# EAGLE design Adafruit USB Serial Char LCD (EAGLE 6.4)
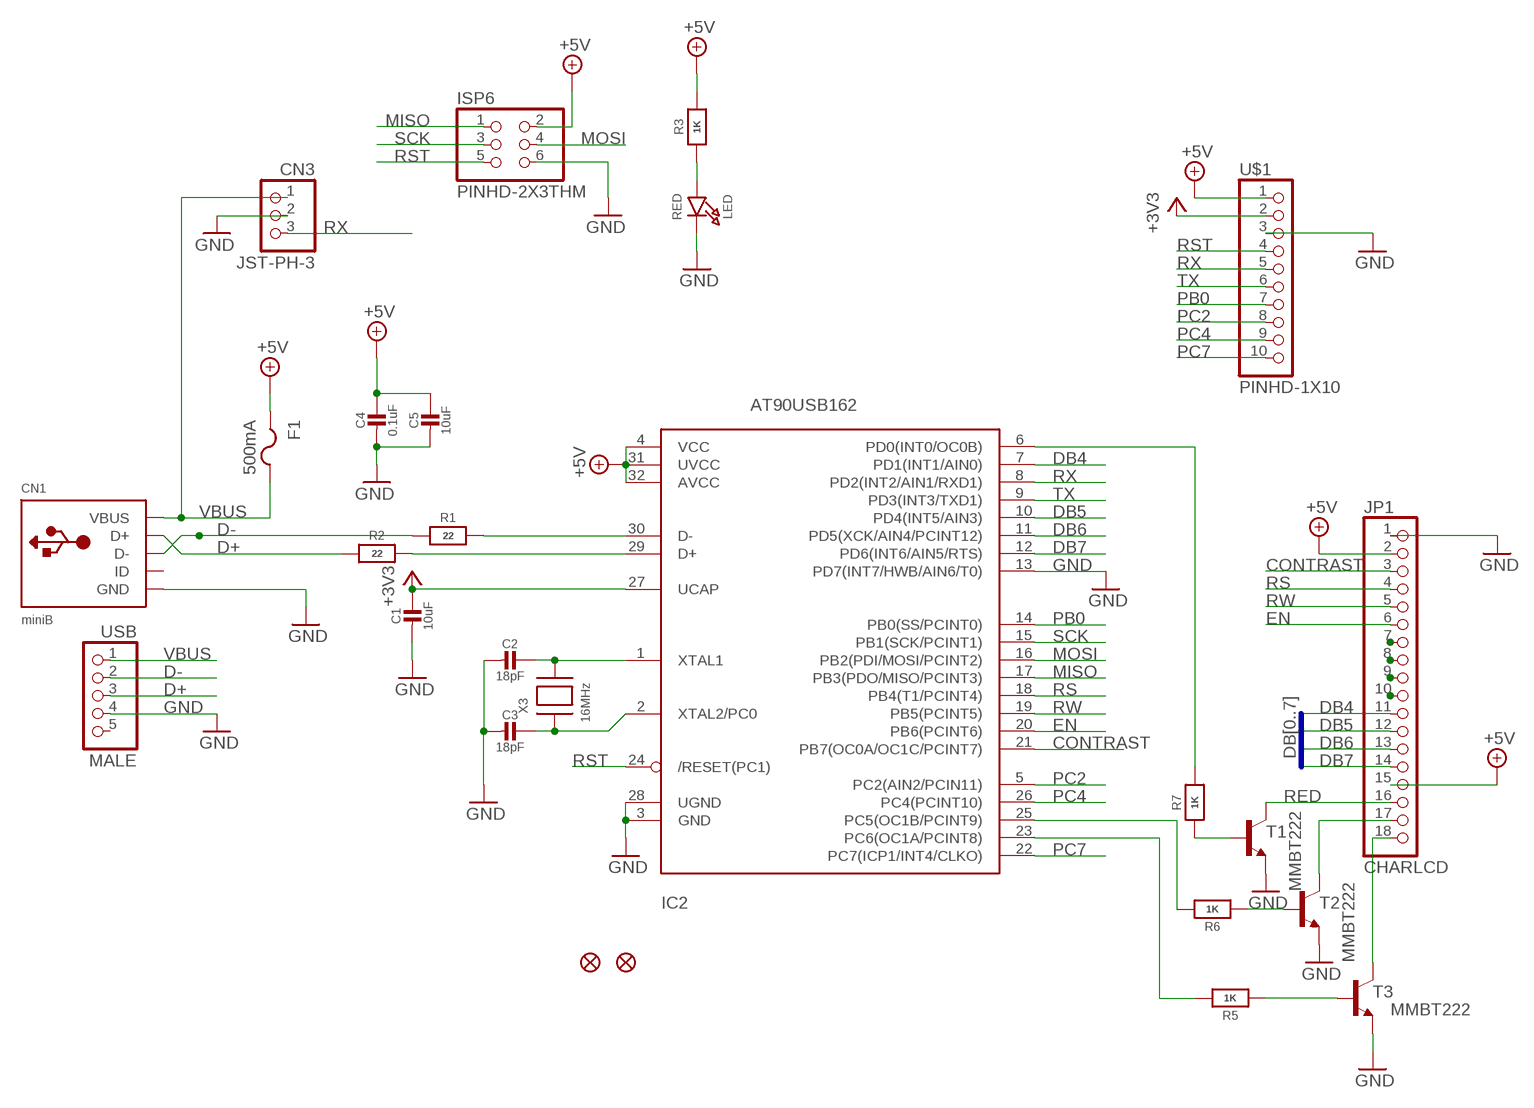
[diagram p0: schematic, sheet 1]

## Parts
C1  10uF  CAP_CERAMIC0805-NOOUTLINE  [0805-NO]
C2  18pF  CAP_CERAMIC0805-NOOUTLINE  [0805-NO]
C3  18pF  CAP_CERAMIC0805-NOOUTLINE  [0805-NO]
C4  0.1uF  CAP_CERAMIC0805-NOOUTLINE  [0805-NO]
C5  10uF  CAP_CERAMIC0805-NOOUTLINE  [0805-NO]
CN1  miniB  USBMINIBLARGE  [USB-MINIB_LARGER]
CN3  JST-PH-3  JST_3PIN  [JSTPH3]
F1  500mA  PTCFUSE-1206  [R1206]
FID1  FIDUCIAL1X2.5  [FIDUCIAL-1X2.5]
FID2  FIDUCIAL1X2.5  [FIDUCIAL-1X2.5]
IC2  AT90USB162  ATMEGA32U2-TQFP  [TQFP32-08]
ISP6  PINHD-2X3THM  [ISP6]
JP1  CHARLCD  PINHD-1X18-BIG  [1X18-BIG]
LED  RED  LED0805_NOOUTLINE  [CHIPLED_0805_NOOUTLINE]
R1  22  RESISTOR0805_NOOUTLINE  [0805-NO]
R2  22  RESISTOR0805_NOOUTLINE  [0805-NO]
R3  1K  RESISTOR0805_NOOUTLINE  [0805-NO]
R5  1K  RESISTOR0805_NOOUTLINE  [0805-NO]
R6  1K  RESISTOR0805_NOOUTLINE  [0805-NO]
R7  1K  RESISTOR0805_NOOUTLINE  [0805-NO]
T1  MMBT222  MMBT2222ALT1-NPN-SOT23-BEC  [SOT23-BEC]
T2  MMBT222  MMBT2222ALT1-NPN-SOT23-BEC  [SOT23-BEC]
T3  MMBT222  MMBT2222ALT1-NPN-SOT23-BEC  [SOT23-BEC]
U$1  PINHD-1X10  [1X10-BIG]
USB  MALE  PINHD-1X5  [1X05]
X3  16MHz  XTALNX5032  [NX5032]

## Nets
+3V3: C1.1 IC2.27(UCAP) U$1.2
+5V: C4.1 C5.1 F1.1 IC2.4(VCC) IC2.31(UVCC) IC2.32(AVCC) ISP6.2 JP1.2 JP1.15 R3.2 U$1.1
BLUE: JP1.18 T3.C
CONTRAST: IC2.21(PB7(OC0A/OC1C/PCINT7)) JP1.3
D+: CN1.D+ R2.1 USB.3
D-: CN1.D- R1.1 USB.2
DB0: JP1.7
DB1: JP1.8
DB2: JP1.9
DB3: JP1.10
DB4: IC2.7(PD1(INT1/AIN0)) JP1.11
DB5: IC2.10(PD4(INT5/AIN3)) JP1.12
DB6: IC2.11(PD5(XCK/AIN4/PCINT12)) JP1.13
DB7: IC2.12(PD6(INT6/AIN5/RTS)) JP1.14
EN: IC2.20(PB6(PCINT6)) JP1.6
GND: C1.2 C2.2 C3.2 C4.2 C5.2 CN1.GND CN3.2 IC2.3(GND) IC2.13(PD7(INT7/HWB/AIN6/T0)) IC2.28(UGND) ISP6.6 JP1.1 LED.C T1.E T2.E T3.E U$1.3 USB.4
GREEN: JP1.17 T2.C
MISO: IC2.17(PB3(PDO/MISO/PCINT3)) ISP6.1
MOSI: IC2.16(PB2(PDI/MOSI/PCINT2)) ISP6.4
N$1: LED.A R3.1
N$2: R7.1 T1.B
N$3: IC2.30(D-) R1.2
N$4: IC2.29(D+) R2.2
N$5: IC2.6(PD0(INT0/OC0B)) R7.2
N$6: R6.1 T2.B
N$7: IC2.25(PC5(OC1B/PCINT9)) R6.2
N$8: C2.1 IC2.1(XTAL1) X3.P$2
N$9: C3.1 IC2.2(XTAL2/PC0) X3.P$1
N$10: IC2.23(PC6(OC1A/PCINT8)) R5.2
N$11: R5.1 T3.B
PB0: IC2.14(PB0(SS/PCINT0)) U$1.7
PC2: IC2.5(PC2(AIN2/PCIN11)) U$1.8
PC4: IC2.26(PC4(PCINT10)) U$1.9
PC7: IC2.22(PC7(ICP1/INT4/CLKO)) U$1.10
RED: JP1.16 T1.C
RS: IC2.18(PB4(T1/PCINT4)) JP1.4
RST: IC2.24(/RESET(PC1)) ISP6.5 U$1.4
RW: IC2.19(PB5(PCINT5)) JP1.5
RX: CN3.3 IC2.8(PD2(INT2/AIN1/RXD1)) U$1.5
SCK: IC2.15(PB1(SCK/PCINT1)) ISP6.3
TX: IC2.9(PD3(INT3/TXD1)) U$1.6
VBUS: CN1.VBUS CN3.1 F1.2 USB.1
Unconnected: CN1.ID USB.5

## Buses
DB[0..7]

## Library data of the parts
C1-C5 = microbuilder:CAP_CERAMIC: Ceramic Capacitors For new designs, use the packages preceded by an '_' character since they are more reliable: The following footprints should be used on most boards: _0402 - Standard footprint for regular board layouts _0603 - Standard footprint for regular board layouts _0805 - Standard footprint for regular board layouts _1206 - Standard footprint for regular board layouts For extremely tight-pitch boards where space is at a premium, the following 'micro-pitch' footprints can be used (smaller pads, no silkscreen outline, etc.): _0402MP - Micro-pitch footprint for very dense/compact boards _0603MP - Micro-pitch footprint for very dense/compact boards _0805MP - Micro-pitch footprint for very dense/compact boards _1206MP - Micro-pitch footprint for very dense/compact boards
CN1 = microbuilder:USB: USB Connectors USBMINIB - Surface Mount Female Mini-B USB Connector 4UConnector: 06564
CN3 = microbuilder:JST_3PIN
F1 = adafruit:PTCFUSE: PTC fuses, resettable thermistors
FID1 FID2 = microbuilder:FIDUCIAL: Fiducial Alignment Points Various fiducial points for machine vision alignment.
IC2 = adafruit:ATMEGA32U2: ATmega32u2 Pin compatible with the atmega8u2, atmega16u2 and atmega32u2 8, 16 or 32 K flash, 1K RAM, 512b EEPROM 8 bit and 16 bit timer (5 PWM total) UART, SPI (no I2C!) USB with 4 endpoints, LUFA compatible 22 I/O lines, analog comparator (no ADC!) Comes with DFU bootloader burned in!
ISP6 = adaprog:PINHD-2X3
JP1 = adafruit:PINHD-1X18: PIN HEADER
LED = microbuilder:LED: LED 0603 - 0603 Surface Mount Package 2mA: Green LED - Low Power (3.9mcd, 2ma, 1.7Vf) - Digikey: 475-2709-2-ND Orange LED - Low Power (9.8mcd, 2ma, 1.8Vf) - Digikey: 475-1194-2-ND Red LED - Low Power (5mcd, 2ma, 1.8Vf) - Digikey: 475-1195-2-ND Yellow LED - Low Power (7mcd, 2ma, 1.8Vf) - Digikey: 475-1196-2-ND 5mA: Blue LED - Low Power (17mcd, 5ma, 2.9Vf) - Digikey: LNJ937W8CRACT-ND 0805 - 0805 Surface Mount Package 2mA: Red LED (8.8mcd, 2mA, 1.8Vf, Clear) - Low Power [Digikey: 475-2510-1-ND] Green LED (5mcd, 2mA, 1.8Vf, Clear) - Low Power [Digikey: 475-2730-1-ND] Yellow LED (11.3mcd, 2mA, 1.8Vf, Clear) - Low Power [Digikey: 475-2555-1-ND] 20mA: Red LED (104mcd, 20mA, Diffused) - LS R976 [Digikey: 475-1278-6-ND] Red LED (12mcd, 20mA, 2.0Vf, Clear) - APT2012EC [Digikey: 754-1128-1-ND] Green LED (15mcd, 20mA, 2.2Vf, Clear) - APT2012GC [Digikey: 754-1131-1-ND] Orange LED (160mcd, 20mA, 2.1Vf, Clear) - APT2012SECK [Digikey: 754-1130-1-ND] 1206 - 1206 Surface Mount Package Green LED (26mcd, 20mA, Diffused) - LG N971 [Digikey: 475-1407-6-ND] Red LED (15mcd, 20mA, Diffused) - LH N974 [Digikey: 475-1416-6-ND] Cree - Cree High-Power Surface Mount LEDs XPEBWT-L1-0000-00D50 - White 111lm 350mA 2.9Vf 6200K 110° XTEAWT-00-0000-00000LEE3 - White 114lm 350mA 2.85Vf 5000K 115° Everlight - Everlight 45-21 Series Surface Mount LEDs 45-21/QK2C-B2832AC2CB2/2T - Warm White 2000mcd 20mA 3.25Vf 3050K 120° 45-21/LK2C-B38452C4CB2/2T - Nuetral White 2000mcd 20mA 3.25Vf 4150K 120° 45-21/LK2C-B50634C6CB2/2T - Cold White 2200mcd 20mA 3.25Vf 5650K 120° PLCC2 Reverse Mount LS T77K-J1L2-1-0-2-R18-Z - Red 11.25mcd 2mA 1.8Vf 630nm 120° LO T77K-L1M2-24-Z - Orange 19.6mcd 2mA 1.8Vf 606nm 120° LY T77K-K2M1-26-Z - Yellow 15.7mcd 2mA 1.8Vf 587nm 120°
R1-R3 R5-R7 = microbuilder:RESISTOR: Resistors For new designs, use the packages preceded by an '_' character since they are more reliable: The following footprints should be used on most boards: _0402 - Standard footprint for regular board layouts _0603 - Standard footprint for regular board layouts _0805 - Standard footprint for regular board layouts _1206 - Standard footprint for regular board layouts For extremely tight-pitch boards where space is at a premium, the following 'micro-pitch' footprints can be used (smaller pads, no silkscreen outline, etc.): _0402MP - Micro-pitch footprint for very dense/compact boards _0603MP - Micro-pitch footprint for very dense/compact boards _0805MP - Micro-pitch footprint for very dense/compact boards _1206MP - Micro-pitch footprint for very dense/compact boards
T1-T3 = transistor:*-NPN-: NPN Transistror BF959 corrected 2008.03.06
U$1 = adafruit:PINHD-1X10: Pin header 1x10 0.1" spacing With round pins
USB = pinhead:PINHD-1X5: PIN HEADER
X3 = adafruit:XTAL: Low cost SMT crystals, no capacitors included http://www.ladyada.net/library/eagle

## Board
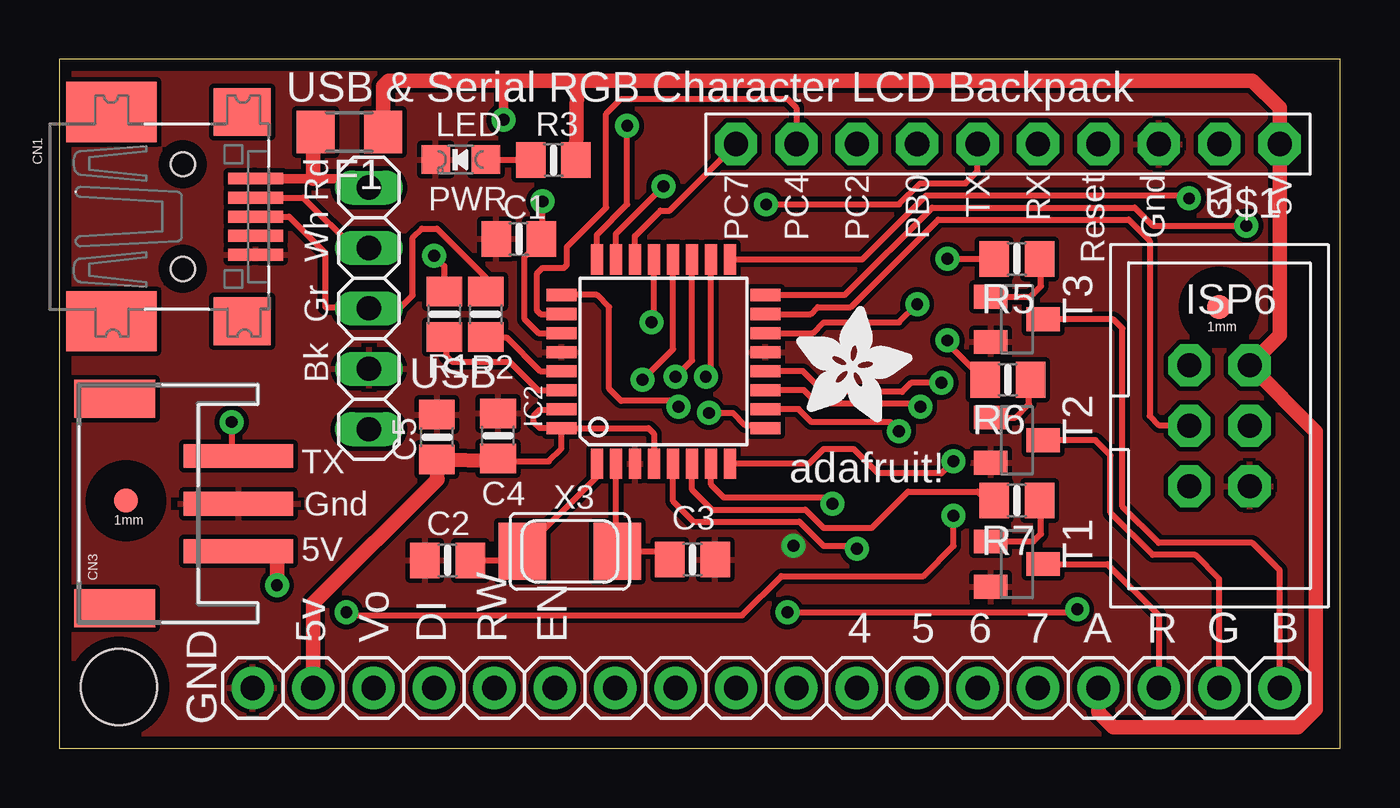
[diagram p1: board, top side]
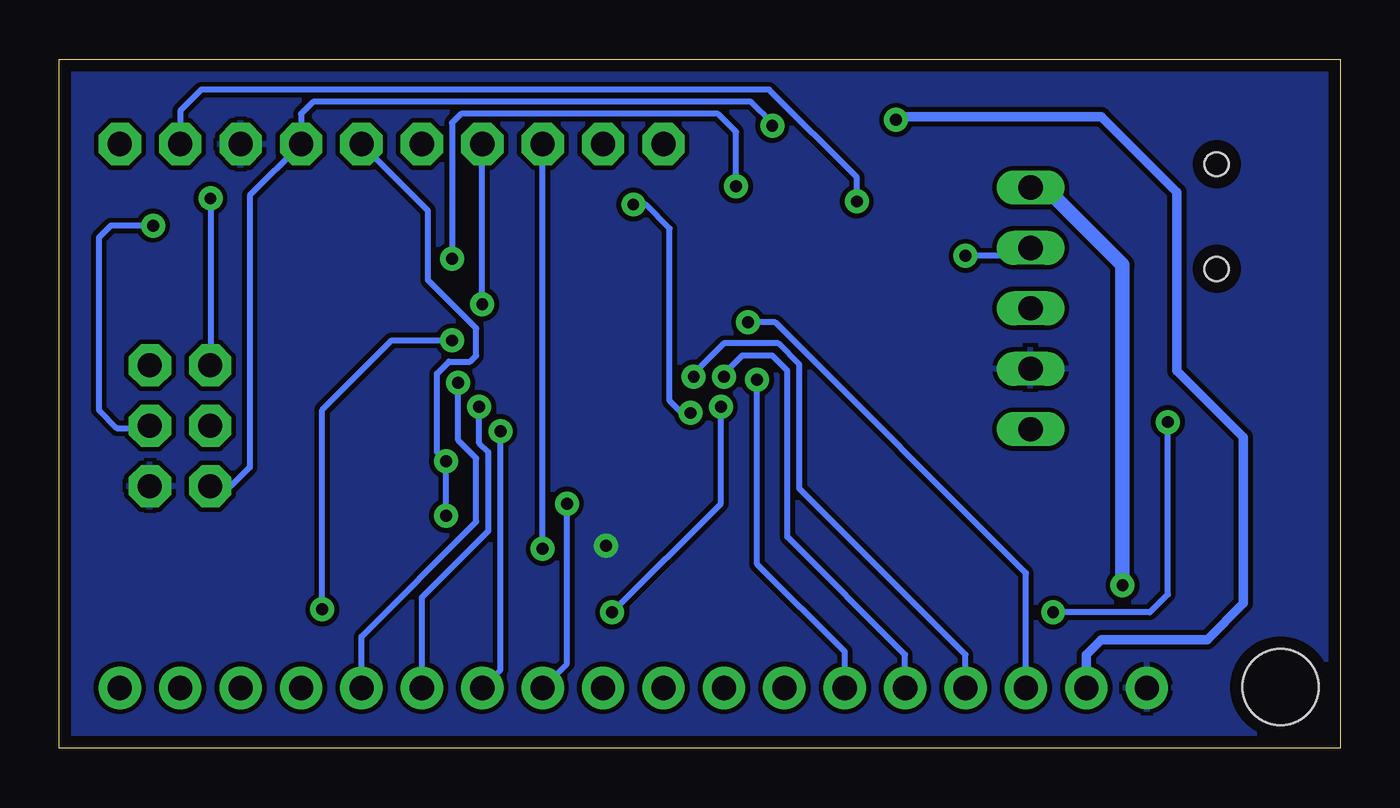
[diagram p2: board, bottom side, seen from below]

Size 53.85 x 28.96 mm. Coordinates in mm from the lower left corner, seen from the top.
Outline: 0,0 53.85,0 53.85,28.96 0,28.96 0,0
Copper layers (1*16): Top 0.035mm / dielectric 1.5mm / Bottom 0.035mm
Design rules "PCBCart-Standard *": minimum track width 8mil, minimum drill 0.4mm, track to track 8mil, track to pad 8mil, pad to pad 8mil, via to via 8mil, smd to smd 8mil, copper to edge 20mil, drill to drill 8mil, minimum pad ring 8mil, minimum via ring 10mil, stop-mask expansion 3mil, vias tented up to drill 20mil, thermal gap 8mil
Holes 3.2 mm at 2.5,2.58
tRestrict: area 7.9,3.6 to 8.4,3.7; area 7.9,1.4 to 8.4,1.5; area 9.1,2.3 to 9.3,2.8; area 49.8,12.1 to 50.3,12.2; area 51.1,10.8 to 51.2,11.3; area 49.8,9.9 to 50.3,10; area 46,26.4 to 46.5,26.5; area 46,24.3 to 46.5,24.4; area 47.2,25.1 to 47.4,25.7; area 12.7,16.9 to 13.3,17; area 12.7,15 to 13.3,15.1; area 4.7,10 to 5,10.5; 2 more areas
bRestrict: area 7.1,2.3 to 7.2,2.8; area 9.1,2.3 to 9.3,2.8; area 7.9,1.4 to 8.4,1.5; area 51.1,10.8 to 51.2,11.3; area 49.8,9.9 to 50.3,10; area 49.8,12.1 to 50.3,12.2; area 47.2,25.1 to 47.4,25.7; area 46,26.4 to 46.5,26.5; area 46,24.3 to 46.5,24.4; area 12.7,15 to 13.3,15.1; area 12.7,16.9 to 13.3,17

### Footprints (pad centres in the part's own frame; a part is rotated, then mirrored left to right if it is on the bottom)
0805-NO = smd 1.24 x 1.5: 1 -0.95,0; 2 0.95,0
USB-MINIB_LARGER = smd 0.5 x 2.308: D+ 0,4.064; D- -0.8,4.064; GND 1.6,4.064; ID 0.8,4.064; VBUS -1.6,4.064 | smd 2.54 x 3.81: GND1 -4.4,-2; GND4 4.4,-2 | smd 2 x 2.4: GND2 -4.4,3.5; GND3 4.4,3.5 | hole 1: -2.2,1; 2.2,1
JSTPH3 = smd 1 x 4.6: 1 -2,-2.7; 2 0,-2.7; 3 2,-2.7 | smd 1.6 x 3.4: NC1 -4.4,2.5; NC2 4.4,2.5
R1206 = smd 1.6 x 1.803: 1 -1.422,0; 2 1.422,0
FIDUCIAL-1X2.5 = smd 1 x 1: 1 0,0
TQFP32-08 = smd 1.27 x 0.508: 1 -4.293,2.8; 2 -4.293,2; 3 -4.293,1.2; 4 -4.293,0.4; 5 -4.293,-0.4; 6 -4.293,-1.2; 7 -4.293,-2; 8 -4.293,-2.8; 17 4.293,-2.8; 18 4.293,-2; 19 4.293,-1.2; 20 4.293,-0.4; 21 4.293,0.4; 22 4.293,1.2; 23 4.293,2; 24 4.293,2.8 | smd 0.508 x 1.27: 9 -2.8,-4.293; 10 -2,-4.293; 11 -1.2,-4.293; 12 -0.4,-4.293; 13 0.4,-4.293; 14 1.2,-4.293; 15 2,-4.293; 16 2.8,-4.293; 25 2.8,4.293; 26 2,4.293; 27 1.2,4.293; 28 0.4,4.293; 29 -0.4,4.293; 30 -1.2,4.293; 31 -2,4.293; 32 -2.8,4.293
ISP6 = drill 1.016 pad 1.778 octagon: 1 -2.54,-1.27; 2 -2.54,1.27; 3 0,-1.27; 4 0,1.27; 5 2.54,-1.27; 6 2.54,1.27
1X18-BIG = drill 1.016 pad 1.778: 1 -21.59,0; 2 -19.05,0; 3 -16.51,0; 4 -13.97,0; 5 -11.43,0; 6 -8.89,0; 7 -6.35,0; 8 -3.81,0; 9 -1.27,0; 10 1.27,0; 11 3.81,0; 12 6.35,0; 13 8.89,0; 14 11.43,0; 15 13.97,0; 16 16.51,0; 17 19.05,0; 18 21.59,0
CHIPLED_0805_NOOUTLINE = smd 1.2 x 1.2: A 0,-1.05; C 0,1.05
SOT23-BEC = smd 1 x 1.4: B -0.95,-1.1; C 0,1.1; E 0.95,-1.1
1X10-BIG = drill 1.016 pad 1.778 octagon: 1 -11.43,0; 2 -8.89,0; 3 -6.35,0; 4 -3.81,0; 5 -1.27,0; 6 1.27,0; 7 3.81,0; 8 6.35,0; 9 8.89,0; 10 11.43,0
1X05 = drill 1.016 long: 1 -5.08,0; 2 -2.54,0; 3 0,0; 4 2.54,0; 5 5.08,0
NX5032 = smd 2 x 2.4: P$1 2,0; P$2 -2,0

### Placement (x,y rotation side)
C1  19.32,21.41 180 top
C2  16.32,7.9 180 top
C3  26.62,7.93 0 top
C4  18.44,13.13 90 top
C5  15.88,13.08 90 top
CN1  4.19,22.35 270 top
CN3  4.83,10.29 90 top
F1  12.19,25.91 180 top
FID1  2.79,10.41 0 top
FID2  48.77,18.54 0 top
IC2  25.4,16.26 90 top
ISP6  48.78,13.56 270 top
JP1  29.72,2.54 0 top
LED  16.87,24.75 90 top
R1  16.18,18.25 270 top
R2  17.93,18.25 270 top
R3  20.77,24.73 0 top
R5  40.26,20.57 180 top
R6  39.88,15.49 180 top
R7  40.26,10.41 180 top
T1  40.26,7.75 270 top
T2  40.26,12.95 270 top
T3  40.26,18.03 270 top
U$1  39.88,25.4 180 top
U$2  [ADAFRUIT_5MM]  30.99,13.72 0 top
USB  13.01,18.49 270 top
X3  21.46,8.28 0 top

### Tracks (layer width: path | path; a pad name or v marks a point on that pad's centre or on a via)
+3V3  (via drill 0.5)
  Top 0.254: IC2.27 20.14,17.46 19.56,18.03 19.56,20.65 C1.1 20.32,21.42 v20.32,22.99
  Bottom 0.254: v20.32,22.99 20.32,24 24,27.69 47.88,27.69 48.77,26.8 U$1.2
+5V  (via drill 0.5)
  Top 0.254: IC2.32 21.11,12.6 20.57,12.06 18.51,12.06 C4.1 | IC2.32 20.2,13.46 19.94,13.72 19.94,13.97 20.19,14.22 21.07,14.22 IC2.31 | IC2.4 25,13.23 24.77,13.46 IC2.32
  Top 0.406: v18.67,26.42 18.67,28.07
  Top 0.61: 21.72,28.07 18.67,28.07 13.84,28.07 13.61,27.84 F1.1 | 21.72,28.07 50.16,28.07 51.31,26.92 U$1.1 51.31,17.36 ISP6.2 52.83,13.31 52.83,1.65 52.07,0.89 44.32,0.89 43.69,1.52 JP1.15 | C4.1 18.39,12.08 C5.1 15.88,11.34 15.89,11.32 10.67,6.1 JP1.2 | R3.2 21.77,28.02 21.72,28.07
  Bottom 0.406: JP1.2 10.67,3.94 10.03,4.57 5.59,4.57 4.06,6.1 4.06,13.08 6.86,15.88 6.86,23.37 10.03,26.54 18.54,26.54 v18.67,26.42
BLUE
  Top 0.254: JP1.18 51.31,7.49 50.16,8.64 46.23,8.64 44.7,10.16 44.7,17.65 44.32,18.03 T3.C
CONTRAST  (via drill 0.5)
  Top 0.254: IC2.21 25,18.02 v24.89,17.91
  Bottom 0.254: v24.89,17.91 23.75,17.91 13.21,7.37 JP1.3
D+
  Top 0.254: CN1.D+ 9.65,22.35 11.18,20.83 11.18,18.54 12.96,18.54 USB.3 13.06,18.54 14.35,18.54 14.86,19.05 14.86,21.46 15.24,21.84 15.88,21.84 17.93,19.79 R2.1
D-  (via drill 0.5)
  Top 0.254: CN1.D- 10.25,23.15 12.45,20.95 13.08,20.95 13.08,20.96 USB.2 | R1.1 16.18,20.27 v15.75,20.7
  Bottom 0.254: v15.75,20.7 13.35,20.7 USB.2
DB4  (via drill 0.5)
  Top 0.254: IC2.7 27.4,11.08 27.94,10.54 32.26,10.54 v32.51,10.29
  Bottom 0.254: v32.51,10.29 32.51,3.56 JP1.11
DB5  (via drill 0.5)
  Top 0.254: IC2.10 31.08,14.26 31.62,13.72 34.92,13.72 v35.31,13.34
  Bottom 0.254: v35.31,13.34 35.31,3.3 JP1.12
DB6  (via drill 0.5)
  Top 0.254: IC2.11 31.3,15.06 31.88,14.48 36.07,14.48 v36.2,14.35
  Bottom 0.254: JP1.13 38.61,6.35 35.81,9.14 35.81,12.45 36.2,12.83 v36.2,14.35
DB7  (via drill 0.5)
  Top 0.254: IC2.12 31.26,15.86 32.13,14.99 35.43,14.99 35.81,15.37 v37.08,15.37
  Bottom 0.254: JP1.14 41.15,4.7 36.32,9.53 36.32,12.19 37.08,12.95 v37.08,15.37
EN  (via drill 0.5)
  Top 0.254: IC2.20 25.8,16.78 v24.51,15.49
  Bottom 0.254: v24.51,15.49 24.51,7.75 20.83,4.06 JP1.6
GND  (via drill 0.5)
  other vias: 30.86,8.51
  pour Top: -0.13,28.83 53.72,28.83 53.72,0 0.25,0
  pour Bottom: -0.25,28.83 53.59,28.83 53.72,0 0.25,0
GREEN
  Top 0.254: JP1.17 48.77,7.11 47.75,8.13 45.97,8.13 44.2,9.91 44.2,12.32 43.56,12.95 T2.C
MISO  (via drill 0.5)
  Top 0.254: IC2.17 33.76,20.55 36.45,23.24 47.37,23.24 v47.5,23.11
  Bottom 0.254: ISP6.1 47.5,16.11 v47.5,23.11
MOSI  (via drill 0.5)
  Top 0.254: v49.91,21.97 45.97,21.97 45.21,22.73 36.7,22.73 33.03,19.06 IC2.16
  Bottom 0.254: v49.91,21.97 51.69,21.97 52.2,21.46 52.2,14.22 51.44,13.46 50.14,13.46 ISP6.4
N$1
  Top 0.254: LED.A 19.75,24.75 R3.1
N$2
  Top 0.254: T1.B 40.95,8.7 41.27,9.02 41.27,10.4 R7.1
N$3
  Top 0.254: IC2.30 20.12,15.06 18.92,16.26 16.51,16.26 16.26,16.51 16.26,17.17 R1.2
N$4
  Top 0.254: IC2.29 20.21,15.86 18.8,17.27 17.95,17.27 R2.2
N$5
  Top 0.254: IC2.6 26.6,10.87 27.43,10.03 31.37,10.03 32.13,9.27 34.16,9.27 35.69,10.79 38.61,10.79 38.99,10.41 R7.2 39.37,10.41
N$6
  Top 0.254: T2.B 40.19,13.9 40.77,14.48 40.77,15.37 40.89,15.49 R6.1
N$7  (via drill 0.5)
  Top 0.254: IC2.25 22.6,19.06 23.11,18.54 23.11,15.11 23.62,14.61 25.78,14.61 v26.04,14.35 | v30.61,5.71 42.67,5.71 v42.8,5.84 | 38.86,15.49 R6.2 | v37.34,17.14 37.34,17.02 38.86,15.49 | 38.86,15.49 39.12,15.24
  Bottom 0.254: v26.04,14.35 26.04,10.29 v30.61,5.71 | v42.8,5.84 42.8,14.22 39.88,17.14 v37.34,17.14
N$8
  Top 0.254: C2.1 19.07,7.9 19.43,8.26 19.44,8.26 X3.P$2 22.6,11.42 IC2.1
N$9
  Top 0.254: X3.P$1 25.27,8.28 C3.1 | IC2.2 23.4,8.79 23.43,8.76 23.5,8.76 | X3.P$1 23.44,8.26 | X3.P$1 23.48,8.26 23.5,8.26 23.5,8.76 | 23.5,8.76 23.37,8.89 | 23.5,8.76 23.5,8.31 X3.P$1
N$10  (via drill 0.5)
  Top 0.254: IC2.23 23.4,21.62 v25.4,23.62 | v37.34,20.57 R5.2
  Bottom 0.254: v25.4,23.62 25.4,25.91 26.16,26.67 36.96,26.67 37.34,26.29 v37.34,20.57
N$11
  Top 0.254: T3.B 40.83,18.98 41.27,19.43 41.27,20.57 R5.1
PB0  (via drill 0.5)
  Top 0.254: IC2.14 31.68,17.46 32.13,17.91 35.31,17.91 v36.07,18.67
  Bottom 0.254: v36.07,18.67 U$1.7
PC2  (via drill 0.5)
  Top 0.254: IC2.5 25.8,10.39 26.67,9.53 31.11,9.53 32.13,8.51 33.4,8.51 v33.53,8.38
  Bottom 0.254: v33.53,8.38 U$1.8
PC4
  Top 0.254: IC2.26 20.23,18.26 20.07,18.41 20.07,19.94 20.32,20.19 21.21,20.19 21.34,20.32 21.34,21.08 22.99,22.73 22.99,26.67 23.62,27.3 30.61,27.3 30.99,26.92 U$1.9
PC7
  Top 0.254: IC2.22 24.2,21.53 25.27,22.61 25.65,22.61 U$1.10
RED
  Top 0.254: JP1.16 46.23,5.59 44.07,7.75 T1.C
RS  (via drill 0.5)
  Top 0.254: IC2.18 27.4,15.84 v27.18,15.62
  Bottom 0.254: v27.18,15.62 27.18,15.75 25.91,17.02 23.62,17.02 22.73,16.13 22.73,10.92 15.75,3.94 JP1.4
RST  (via drill 0.5)
  Top 0.254: IC2.24 22.6,21.58 23.88,22.86 v23.88,26.16
  Bottom 0.254: v23.88,26.16 23.88,26.29 24.77,27.18 43.18,27.18 43.69,26.67 U$1.4 45.85,23.24 45.85,11.81 46.64,11.02 ISP6.5
RW  (via drill 0.5)
  Top 0.254: IC2.19 26.6,16.31 v25.91,15.62
  Bottom 0.254: v25.91,15.62 25.91,15.75 25.15,16.51 23.88,16.51 23.24,15.88 23.24,8.89 18.29,3.94 JP1.5
RX  (via drill 0.5)
  Top 0.254: IC2.8 31.52,11.96 32.13,12.57 33.4,12.57 34.42,11.56 37.08,11.56 v37.59,12.06 | v37.59,9.78 37.59,8.51 36.32,7.24 30.35,7.24 28.7,5.59 12.19,5.59 v12.06,5.71 | v7.24,13.72 7.24,12.57 CN3.3
  Bottom 0.254: U$1.5 38.35,22.61 38.35,19.68 36.32,17.65 36.32,16.51 36.58,16.26 37.47,16.26 37.97,15.75 37.97,12.45 v37.59,12.06 v37.59,9.78 | v12.06,5.71 8,5.71 7.24,6.48 v7.24,13.72
SCK
  Top 0.254: ISP6.3 47.48,13.59 46.23,13.59 45.85,13.97 45.85,21.34 44.96,22.23 36.96,22.23 33.27,18.54 31.88,18.54 31.59,18.26 IC2.15
TX  (via drill 0.5)
  Top 0.254: v29.72,22.86 35.31,22.86 36.2,23.75 38.1,23.75 38.61,24.26 U$1.6 | v27.3,14.1 28.32,14.1 28.83,13.59 29.56,13.59 IC2.9
  Bottom 0.254: v29.72,22.86 29.21,22.86 28.19,21.84 28.19,14.61 27.69,14.1 v27.3,14.1
VBUS  (via drill 0.5)
  Top 0.406: USB.1 12.63,23.95 10.67,23.95 CN1.VBUS 8.2,24
  Top 0.61: CN3.1 9.14,8.29 v9.14,6.86 | F1.2 10.67,25.81 10.67,23.95
  Bottom 0.61: v9.14,6.86 9.14,20.32 12.45,23.62 12.95,23.62 USB.1

### Text on the board
tPlace: USB & Serial RGB Character LCD Backpack | PC7 | PC4 | PC2 | PB0 | TX | RX | Reset | Gnd | 3V | 5V | Rd | PWR | Wh | Gr | Bk | TX | adafruit! | Gnd | 5V | 5v | Vo | DI | RW | EN | 4 | 5 | 6 | 7 | A | R | G | B | GND